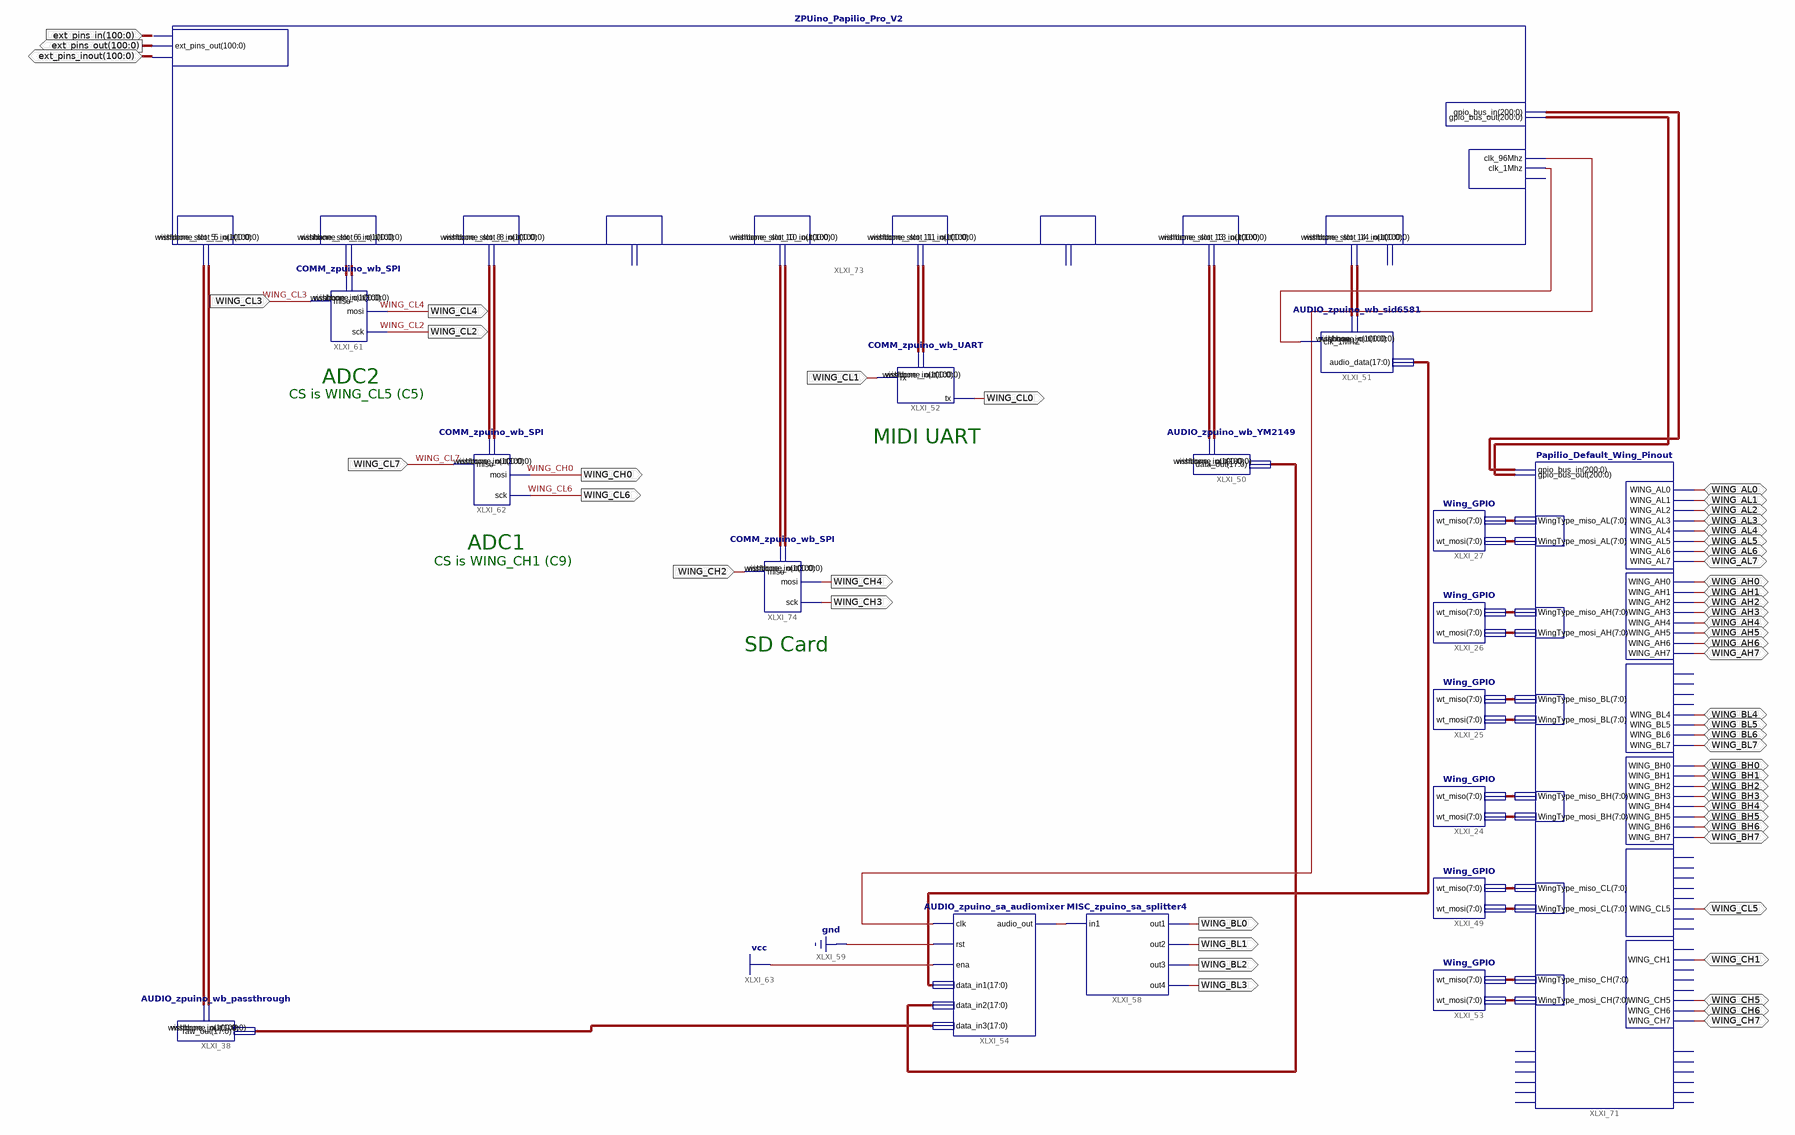
[diagram p0: schematic sheet 1]
// Xilinx ISE schematic Papilio_Pro.sch (spartan6) as structural Verilog: 17 symbols, 51 ports
module Papilio_Pro (
  input  WING_CL3,
  input  WING_CL7,
  input  WING_CL1,
  input  [100:0] ext_pins_in,
  input  WING_CH2,
  inout  WING_AL0,
  inout  WING_AL1,
  inout  WING_AL2,
  inout  WING_AL3,
  inout  WING_AL4,
  inout  WING_AL5,
  inout  WING_AL6,
  inout  WING_AL7,
  inout  WING_AH0,
  inout  WING_AH1,
  inout  WING_AH2,
  inout  WING_AH3,
  inout  WING_AH4,
  inout  WING_AH5,
  inout  WING_AH6,
  inout  WING_AH7,
  inout  WING_BL4,
  inout  WING_BL5,
  inout  WING_BL6,
  inout  WING_BL7,
  inout  WING_BH0,
  inout  WING_BH1,
  inout  WING_BH2,
  inout  WING_BH3,
  inout  WING_BH4,
  inout  WING_BH5,
  inout  WING_BH6,
  inout  WING_BH7,
  inout  WING_CL5,
  inout  WING_CH1,
  inout  WING_CH5,
  inout  WING_CH6,
  inout  WING_CH7,
  inout  [100:0] ext_pins_inout,
  output WING_BL0,
  output WING_BL1,
  output WING_BL2,
  output WING_BL3,
  output WING_CL4,
  output WING_CL2,
  output WING_CH0,
  output WING_CL6,
  output WING_CL0,
  output [100:0] ext_pins_out,
  output WING_CH3,
  output WING_CH4
);

  wire XLXN_504, XLXN_509, XLXN_511;
  wire [7:0] XLXN_582, XLXN_583, XLXN_584, XLXN_585, XLXN_586, XLXN_587, XLXN_588, XLXN_589, XLXN_590,
       XLXN_591, XLXN_592, XLXN_593;
  wire [17:0] XLXN_514, XLXN_681, XLXN_682;
  wire [100:0] XLXN_598, XLXN_599, XLXN_600, XLXN_601, XLXN_606, XLXN_607, XLXN_610, XLXN_611, XLXN_612,
       XLXN_613, XLXN_676, XLXN_677, XLXN_683, XLXN_684;
  wire [200:0] XLXN_594, XLXN_595;

  AUDIO_zpuino_wb_passthrough XLXI_38 (.raw_out(XLXN_682), .wishbone_in(XLXN_676), .wishbone_out(XLXN_677));
  AUDIO_zpuino_sa_audiomixer XLXI_54 (
    .clk(XLXN_511), .rst(1'b0), .ena(1'b1), .data_in1(XLXN_514), .data_in2(XLXN_681), .data_in3(XLXN_682),
    .audio_out(XLXN_504));
  MISC_zpuino_sa_splitter4 XLXI_58 (.in1(XLXN_504), .out1(WING_BL0), .out2(WING_BL1), .out3(WING_BL2), .out4(WING_BL3));
  Papilio_Default_Wing_Pinout XLXI_71 (
    .WING_AH0(WING_AH0), .WING_AH1(WING_AH1), .WING_AH2(WING_AH2), .WING_AH3(WING_AH3), .WING_AH4(WING_AH4),
    .WING_AH5(WING_AH5), .WING_AH6(WING_AH6), .WING_AH7(WING_AH7), .WING_AL0(WING_AL0), .WING_AL1(WING_AL1),
    .WING_AL2(WING_AL2), .WING_AL3(WING_AL3), .WING_AL4(WING_AL4), .WING_AL5(WING_AL5), .WING_AL6(WING_AL6),
    .WING_AL7(WING_AL7), .WING_BH0(WING_BH0), .WING_BH1(WING_BH1), .WING_BH2(WING_BH2), .WING_BH3(WING_BH3),
    .WING_BH4(WING_BH4), .WING_BH5(WING_BH5), .WING_BH6(WING_BH6), .WING_BH7(WING_BH7), .WING_BL4(WING_BL4),
    .WING_BL5(WING_BL5), .WING_BL6(WING_BL6), .WING_BL7(WING_BL7), .WING_CL5(WING_CL5), .WING_CH1(WING_CH1),
    .WING_CH5(WING_CH5), .WING_CH6(WING_CH6), .WING_CH7(WING_CH7), .gpio_bus_out(XLXN_595),
    .gpio_bus_in(XLXN_594), .WingType_miso_BH(XLXN_588), .WingType_miso_BL(XLXN_586),
    .WingType_miso_AH(XLXN_584), .WingType_mosi_BL(XLXN_587), .WingType_mosi_BH(XLXN_589),
    .WingType_mosi_CL(XLXN_591), .WingType_mosi_AH(XLXN_585), .WingType_miso_CL(XLXN_590),
    .WingType_miso_CH(XLXN_592), .WingType_mosi_CH(XLXN_593), .WingType_mosi_AL(XLXN_583),
    .WingType_miso_AL(XLXN_582));  // open: WING_BL0, WING_BL1, WING_BL2, WING_BL3, WING_CL0, WING_CL1, WING_CL2, WING_CL3, WING_CL4, WING_CL6, WING_CL7, WING_CH0, WING_CH2, WING_CH3, WING_CH4, Flex_Pin_out_0, Flex_Pin_out_1, Flex_Pin_out_2, Flex_Pin_out_3, Flex_Pin_out_4, Flex_Pin_out_5, Flex_Pin_in_0, Flex_Pin_in_1, Flex_Pin_in_2, Flex_Pin_in_3, Flex_Pin_in_4, Flex_Pin_in_5
  Wing_GPIO XLXI_49 (.wt_miso(XLXN_590), .wt_mosi(XLXN_591));
  Wing_GPIO XLXI_26 (.wt_miso(XLXN_584), .wt_mosi(XLXN_585));
  Wing_GPIO XLXI_25 (.wt_miso(XLXN_586), .wt_mosi(XLXN_587));
  Wing_GPIO XLXI_24 (.wt_miso(XLXN_588), .wt_mosi(XLXN_589));
  Wing_GPIO XLXI_53 (.wt_miso(XLXN_592), .wt_mosi(XLXN_593));
  Wing_GPIO XLXI_27 (.wt_miso(XLXN_582), .wt_mosi(XLXN_583));
  ZPUino_Papilio_Pro_V2 XLXI_73 (
    .gpio_bus_out(XLXN_595), .gpio_bus_in(XLXN_594), .clk_96Mhz(XLXN_511), .clk_1Mhz(XLXN_509),
    .ext_pins_in(ext_pins_in), .ext_pins_out(ext_pins_out), .ext_pins_inout(ext_pins_inout),
    .wishbone_slot_5_out(XLXN_677), .wishbone_slot_5_in(XLXN_676), .wishbone_slot_6_in(XLXN_598),
    .wishbone_slot_6_out(XLXN_599), .wishbone_slot_8_in(XLXN_600), .wishbone_slot_8_out(XLXN_601),
    .wishbone_slot_10_in(XLXN_683), .wishbone_slot_10_out(XLXN_684), .wishbone_slot_11_in(XLXN_606),
    .wishbone_slot_11_out(XLXN_607), .wishbone_slot_13_in(XLXN_610), .wishbone_slot_13_out(XLXN_611),
    .wishbone_slot_14_in(XLXN_612), .wishbone_slot_14_out(XLXN_613));  // open: clk_osc_32Mhz, wishbone_slot_9_in, wishbone_slot_9_out, wishbone_slot_12_in, wishbone_slot_12_out, wishbone_slot_video_in, wishbone_slot_video_out
  COMM_zpuino_wb_SPI XLXI_61 (
    .miso(WING_CL3), .sck(WING_CL2), .mosi(WING_CL4), .wishbone_in(XLXN_598), .wishbone_out(XLXN_599));
  COMM_zpuino_wb_SPI XLXI_62 (
    .miso(WING_CL7), .sck(WING_CL6), .mosi(WING_CH0), .wishbone_in(XLXN_600), .wishbone_out(XLXN_601));
  COMM_zpuino_wb_UART XLXI_52 (.rx(WING_CL1), .wishbone_in(XLXN_606), .wishbone_out(XLXN_607), .tx(WING_CL0));
  AUDIO_zpuino_wb_YM2149 XLXI_50 (.data_out(XLXN_681), .wishbone_in(XLXN_610), .wishbone_out(XLXN_611));
  AUDIO_zpuino_wb_sid6581 XLXI_51 (
    .clk_1MHZ(XLXN_509), .audio_data(XLXN_514), .wishbone_in(XLXN_612), .wishbone_out(XLXN_613));
  COMM_zpuino_wb_SPI XLXI_74 (
    .miso(WING_CH2), .sck(WING_CH3), .mosi(WING_CH4), .wishbone_in(XLXN_683), .wishbone_out(XLXN_684));

  // Notes on the sheet:
  //   ADC2
  //   CS is WING_CL5 (C5)
  //   MIDI UART
  //   ADC1
  //   CS is WING_CH1 (C9)
  //   SD Card
endmodule
